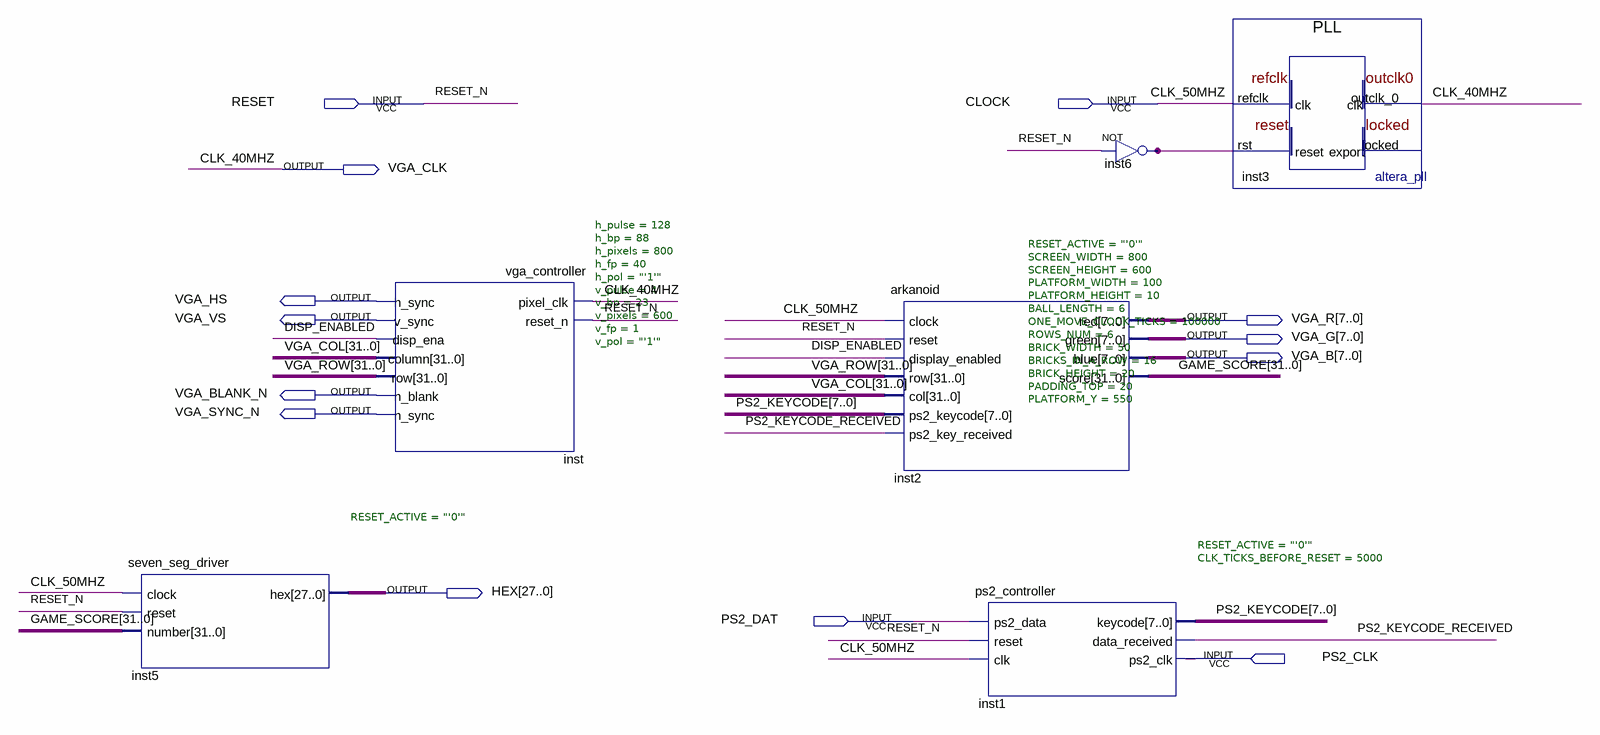
[diagram p0: schematic sheet]
// Quartus schematic arkanoid_top.bdf as structural Verilog: 6 symbols, 13 pins
module arkanoid_top (
  input  RESET,
  input  CLOCK,
  input  PS2_DAT,
  input  PS2_CLK,
  output VGA_CLK,
  output VGA_HS,
  output VGA_VS,
  output [7:0] VGA_R,
  output [7:0] VGA_G,
  output [7:0] VGA_B,
  output VGA_BLANK_N,
  output VGA_SYNC_N,
  output [27:0] HEX
);

  wire DISP_ENABLED, inst6_out, PS2_KEYCODE_RECEIVED;
  wire [7:0] PS2_KEYCODE;
  wire [31:0] GAME_SCORE, VGA_COL, VGA_ROW;

  seven_seg_driver #(.RESET_ACTIVE("'0'")) inst5 (.clock(CLOCK), .reset(RESET), .number(GAME_SCORE), .hex(HEX));
  vga_controller #(.h_pulse(128), .h_bp(88), .h_pixels(800), .h_fp(40), .h_pol("'1'"), .v_pulse(4), .v_bp(23), .v_pixels(600), .v_fp(1), .v_pol("'1'")) inst (
    .pixel_clk(VGA_CLK), .reset_n(RESET), .h_sync(VGA_HS), .v_sync(VGA_VS), .disp_ena(DISP_ENABLED),
    .column(VGA_COL), .row(VGA_ROW), .n_blank(VGA_BLANK_N), .n_sync(VGA_SYNC_N));
  arkanoid #(.RESET_ACTIVE("'0'"), .SCREEN_WIDTH(800), .SCREEN_HEIGHT(600), .PLATFORM_WIDTH(100), .PLATFORM_HEIGHT(10), .BALL_LENGTH(6), .ONE_MOVE_CLOCK_TICKS(100000), .ROWS_NUM(6), .BRICK_WIDTH(50), .BRICKS_IN_A_ROW(16), .BRICK_HEIGHT(20), .PADDING_TOP(20), .PLATFORM_Y(550)) inst2 (
    .clock(CLOCK), .reset(RESET), .display_enabled(DISP_ENABLED), .row(VGA_ROW), .col(VGA_COL),
    .ps2_keycode(PS2_KEYCODE), .ps2_key_received(PS2_KEYCODE_RECEIVED), .red(VGA_R), .green(VGA_G),
    .blue(VGA_B), .score(GAME_SCORE));
  ps2_controller #(.RESET_ACTIVE("'0'"), .CLK_TICKS_BEFORE_RESET(5000)) inst1 (
    .ps2_data(PS2_DAT), .reset(RESET), .clk(CLOCK), .keycode(PS2_KEYCODE),
    .data_received(PS2_KEYCODE_RECEIVED), .ps2_clk(PS2_CLK));
  not inst6 (inst6_out, RESET);
  PLL inst3 (.refclk(CLOCK), .rst(inst6_out), .outclk_0(VGA_CLK));  // open: locked

  // Other names for the same wires on the sheet: CLK_40MHZ = VGA_CLK; CLK_50MHZ = CLOCK; RESET_N = RESET
endmodule
